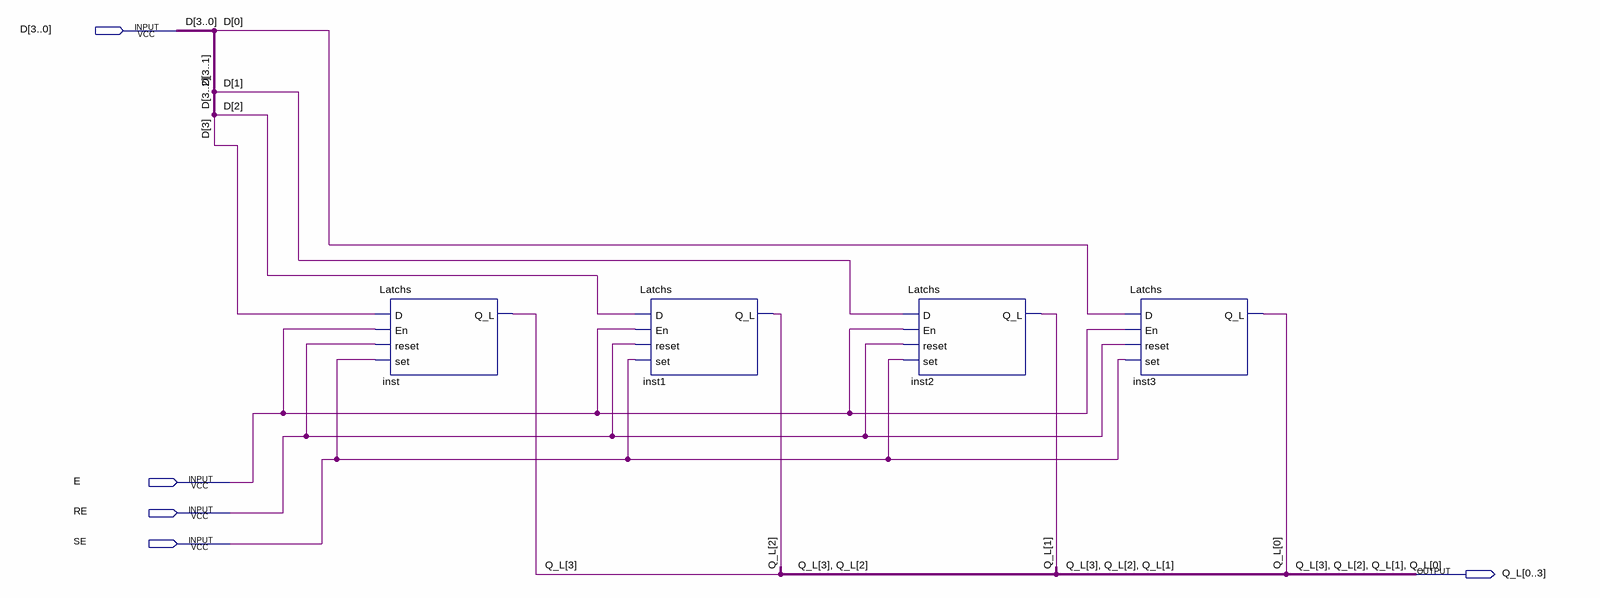
[diagram p0: schematic sheet]
// Quartus schematic LAB_3_2.bdf as structural Verilog: 4 symbols, 5 pins
module LAB_3_2 (
  input  [3:0] D,
  input  E,
  input  RE,
  input  SE,
  output [0:3] Q_L
);

  Latchs inst (.D(D[3]), .En(E), .reset(RE), .set(SE), .Q_L(Q_L[3]));
  Latchs inst1 (.D(D[2]), .En(E), .reset(RE), .set(SE), .Q_L(Q_L[2]));
  Latchs inst2 (.D(D[1]), .En(E), .reset(RE), .set(SE), .Q_L(Q_L[1]));
  Latchs inst3 (.D(D[0]), .En(E), .reset(RE), .set(SE), .Q_L(Q_L[0]));
endmodule
